# EAGLE design power-distribution (EAGLE 9.6.2)
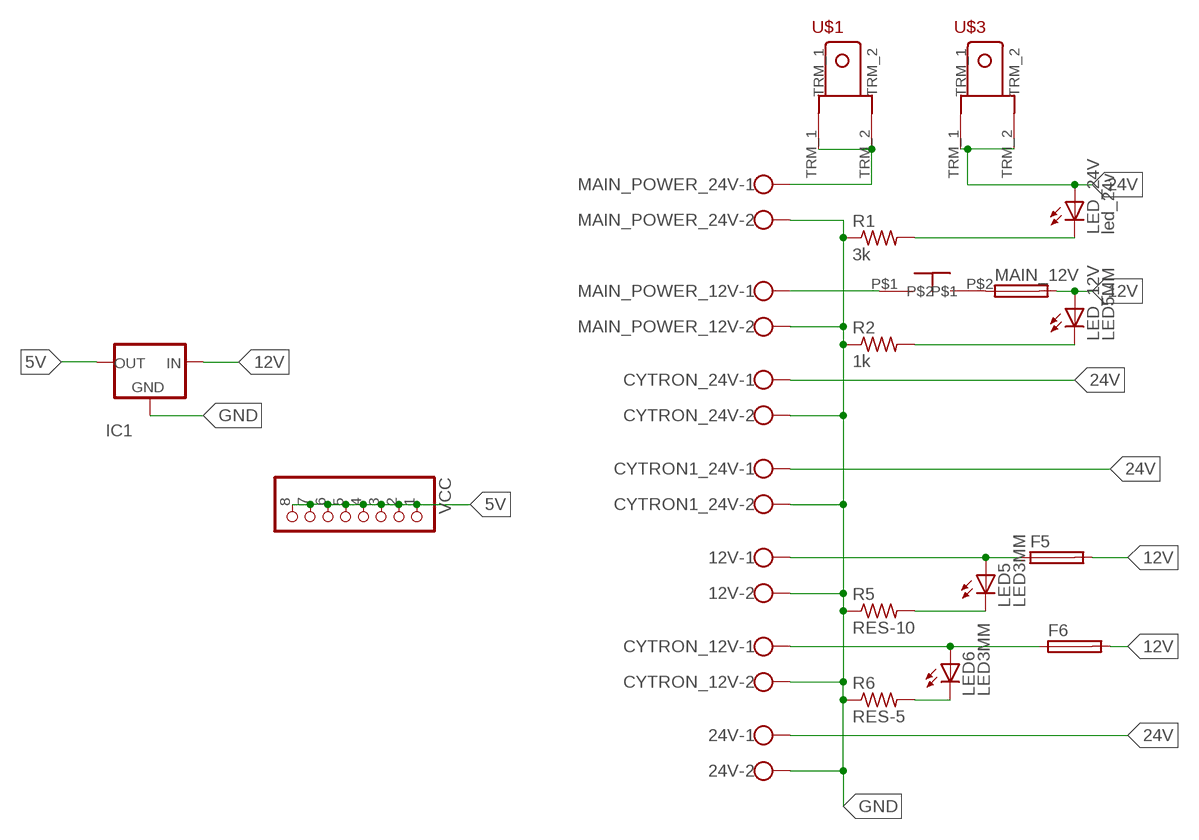
[diagram p0: schematic, sheet 1]

## Parts
12V  ROSTA.POWER  [W239-302]
24V  ROSTA.POWER  [W239-302]
CYTRON1_24V  ROSTA.POWER  [W239-302]
CYTRON_12V  ROSTA.POWER  [W239-302]
CYTRON_24V  ROSTA.POWER  [W239-302]
F5  FUSE_HOLDER  [SH22,5A]
F6  FUSE_HOLDER  [SH22,5A]
IC1  78XX-METAL  [TO3-79]
LED5  LED3MM  [LED3MM]
LED6  LED3MM  [LED3MM]
LED_12V  LED5MM  [LED5MM]
LED_24V  led_24v  LED5MM  [LED5MM]
MAIN_12V  FUSE_HOLDER  [SH22,5A]
MAIN_POWER_12V  ROSTA.POWER  [W239-302]
MAIN_POWER_24V  ROSTA.POWER  [W239-302]
R1  3k  RES-5  [0204/5]
R2  1k  RES-12  [0207/12]
R5  RES-10  [0207/10]
R6  RES-5  [0204/5]
U$1  TERMINAL_EDITED  [TERMINAL_EDITED]
U$2  SWITCH_2  [ON_OFF]
U$3  TERMINAL_EDITED  [TERMINAL_EDITED]
VCC  PINHD-1X8  [1X08]

## Nets
5V: IC1.1(OUT) VCC.1 VCC.2 VCC.3 VCC.4 VCC.5 VCC.6 VCC.7 VCC.8
12V: F5.2 F6.2 IC1.3(IN) LED_12V.A MAIN_12V.2
24V: 24V.1 CYTRON1_24V.1 CYTRON_24V.1 LED_24V.A U$3.TRM_1 U$3.TRM_2
GND: 12V.2 24V.2 CYTRON1_24V.2 CYTRON_12V.2 CYTRON_24V.2 IC1.2(GND) MAIN_POWER_12V.2 MAIN_POWER_24V.2 R1.1 R2.1 R5.1 R6.1
N$1: CYTRON_12V.1 F6.1 LED6.A
N$2: LED_24V.K(C) R1.2
N$3: MAIN_POWER_24V.1 U$1.TRM_1 U$1.TRM_2
N$4: LED_12V.K(C) R2.2
N$5: MAIN_POWER_12V.1 U$2.P$1
N$11: 12V.1 F5.1 LED5.A
N$12: LED5.K(C) R5.2
N$13: MAIN_12V.1 U$2.P$2
N$15: LED6.K(C) R6.2

## Library data of the parts
12V 24V CYTRON1_24V CYTRON_12V CYTRON_24V MAIN_POWER_12V MAIN_POWER_24V = MIA_LIBRARY-2-2-2:ROSTA.POWER: WAGO SCREW CLAMP; OC_FARNELL: unknown; OC_NEWARK: unknown
F5 F6 MAIN_12V = MIA_LIBRARY-2-2-2:FUSE_HOLDER
IC1 = MIA_LIBRARY-2-2-2:78XX-METAL: VOLTAGE REGULATOR
LED5 LED6 = MIA_LIBRARY-2-2-2:LED3MM
LED_12V LED_24V = MIA_LIBRARY-2-2-2:LED5MM
R1 R6 = MIA_LIBRARY-2-2-2:RES-5
R2 = MIA_LIBRARY-2-2-2:RES-12
R5 = MIA_LIBRARY-2-2-2:RES-10
U$1 U$3 = MIA_LIBRARY-2-2-2:TERMINAL_EDITED
U$2 = MIA_LIBRARY-2-2-2:SWITCH_2
VCC = MIA_LIBRARY-2-2-2:PINHD-1X8: PIN HEADER

## Board
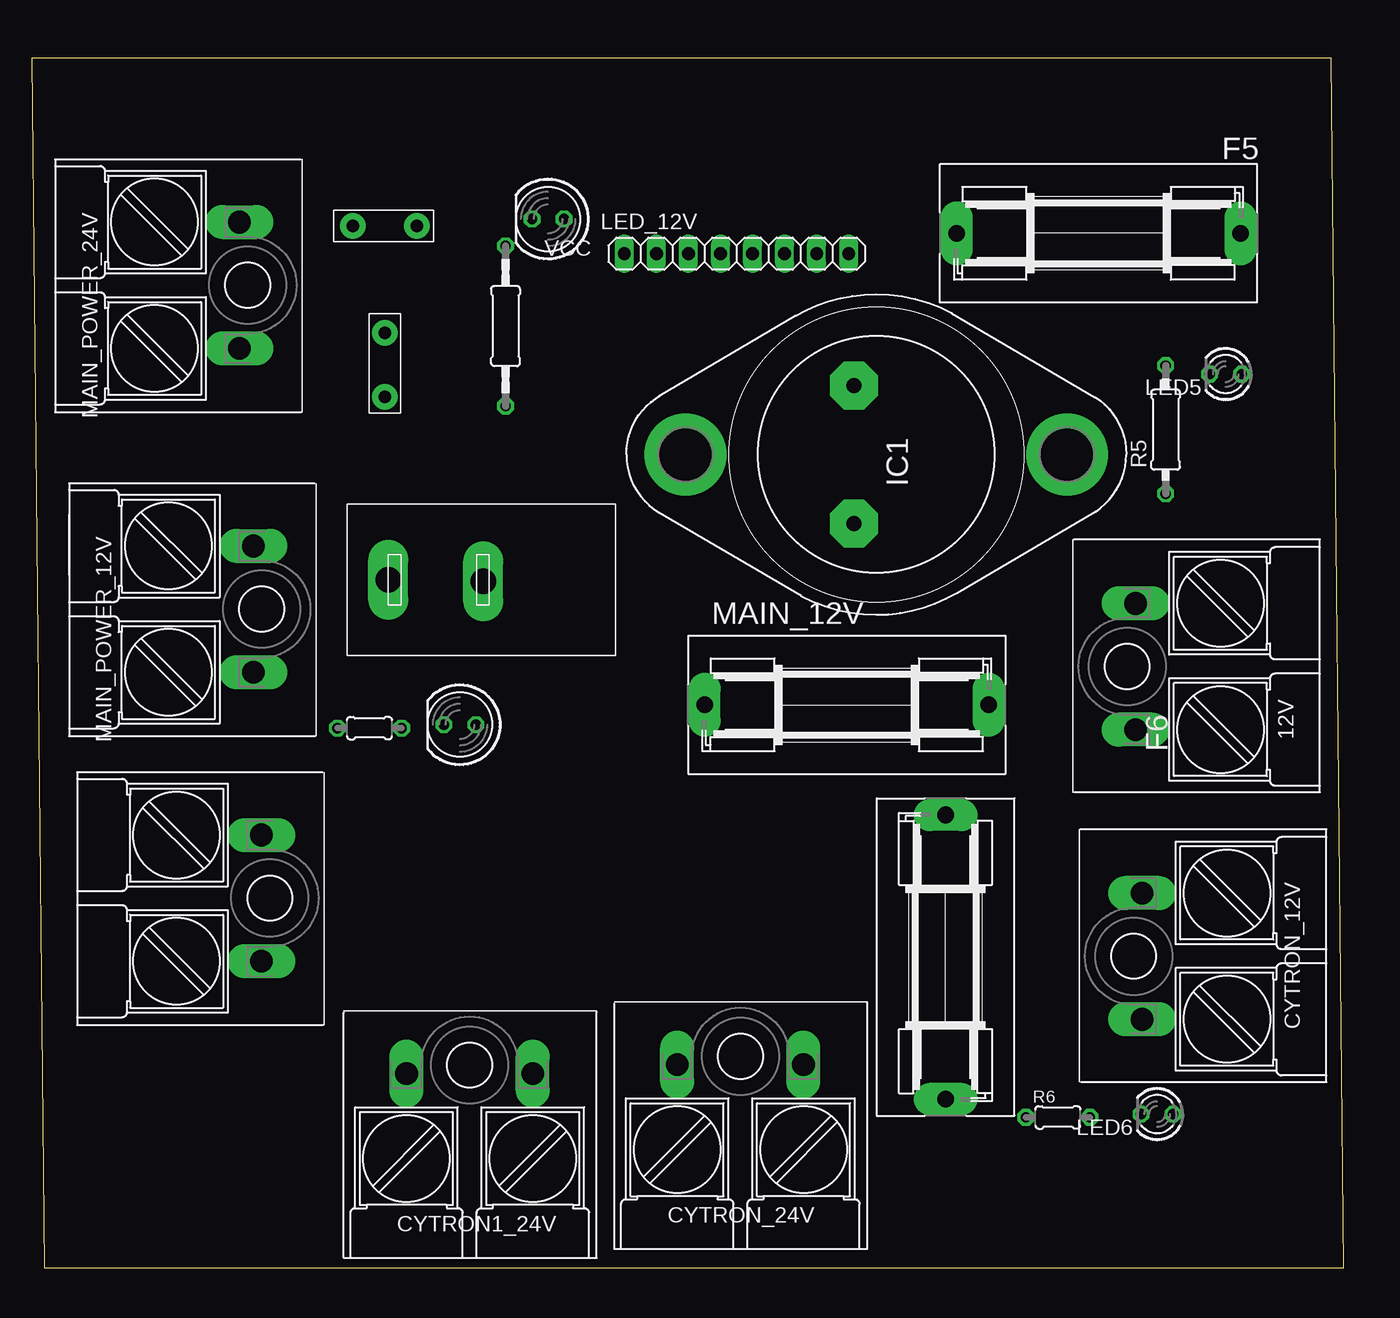
[diagram p1: board, top side]
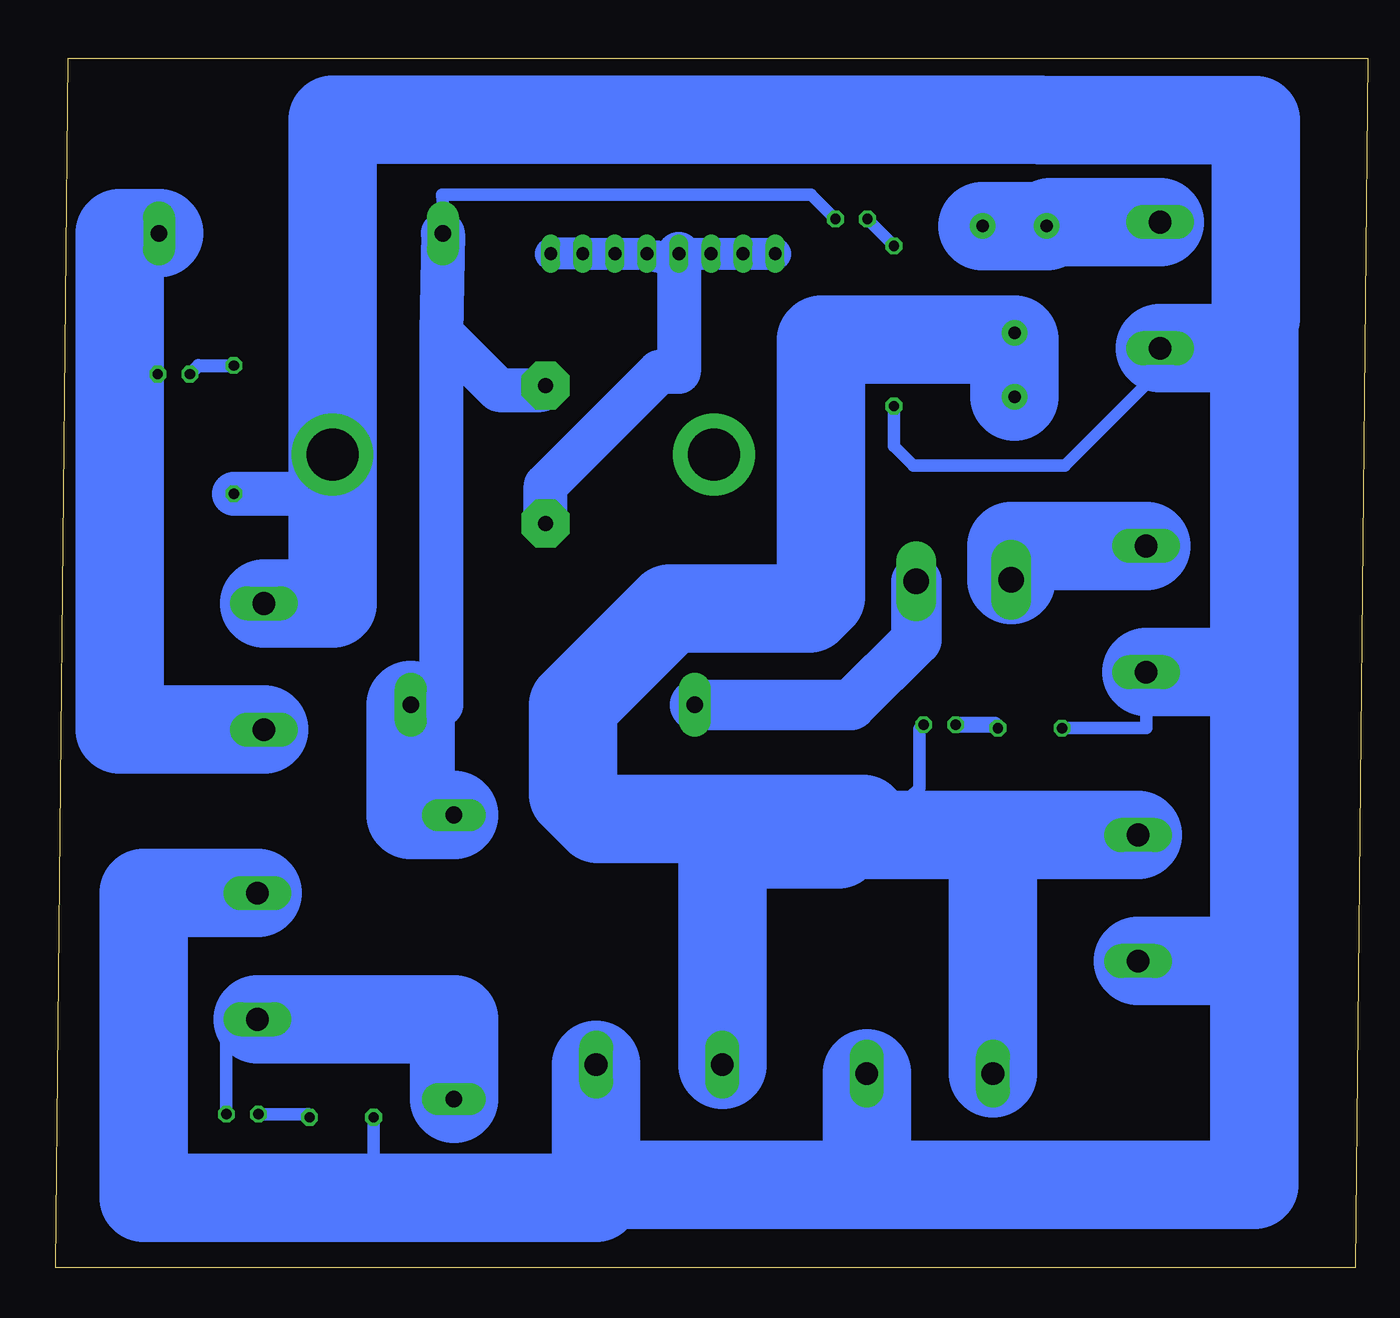
[diagram p2: board, bottom side, seen from below]

Size 104 x 95.84 mm. Coordinates in mm from the lower left corner, seen from the top.
Outline: 1,0 104,0 103,95.84 0,95.84 1,0
Copper layers (1*16): Top 0.035mm / dielectric 1.5mm / Bottom 0.035mm
Design rules "default *": minimum track width 1mm, minimum drill 0.6mm, track to track 0.6mm, track to pad 0.6mm, pad to pad 6mil, via to via 6mil, smd to smd 6mil, copper to edge 0.6mm, drill to drill 6mil, minimum pad ring 10mil, minimum via ring 8mil, stop-mask expansion 4mil, vias tented up to drill 0mil, thermal gap 10mil

### Footprints (pad centres in the part's own frame; a part is rotated, then mirrored left to right if it is on the bottom)
W239-302 = drill 1.8 long: 1 -5,5; 2 5,5
SH22,5A = drill 1.321 pad 2.54 long: 1 -11.252,0; 2 11.252,0
TO3-79 = drill 1.194 pad 3.81 octagon: 1 -1.778,-5.461; 3 -1.778,5.461 | drill 4.115 pad 6.477: 2 15.113,0; 3@ -15.113,0
LED3MM = drill 0.813 octagon: A -1.27,0; K 1.27,0
LED5MM = drill 0.813 octagon: A -1.27,0; K 1.27,0
0204/5 = drill 0.813 octagon: 1 -2.54,0; 2 2.54,0
0207/12 = drill 0.813 octagon: 1 -6.35,0; 2 6.35,0
0207/10 = drill 0.813 octagon: 1 -5.08,0; 2 5.08,0
TERMINAL_EDITED = drill 1 pad 2.032: TRM_1 -2.54,0; TRM_2 2.54,0
ON_OFF = drill 2.032 pad 3.175 long: P$1 3.27,5.952; P$2 10.795,5.842
1X08 = drill 1.016 long: 1 -8.89,0; 2 -6.35,0; 3 -3.81,0; 4 -1.27,0; 5 1.27,0; 6 3.81,0; 7 6.35,0; 8 8.89,0

### Placement (x,y rotation side)
12V  92.48,47.63 90 top
24V  13.22,29.28 270 top
CYTRON1_24V  34.72,10.38 0 top
CYTRON_12V  93,24.67 90 top
CYTRON_24V  56.16,11.08 0 top
F5  84.55,81.96 180 top
F6  72.43,24.61 90 top
IC1  66.94,64.43 0 top
LED5  94.62,70.8 180 top
LED6  89.19,12.15 180 top
LED_12V  40.93,83.09 180 top
LED_24V  33.94,43.02 180 top
MAIN_12V  64.6,44.59 0 top
MAIN_POWER_12V  12.57,52.18 270 top
MAIN_POWER_24V  11.48,77.85 270 top
R1  26.78,42.75 0 top
R2  37.56,74.61 90 top
R5  89.87,66.4 90 top
R6  81.33,11.9 0 top
U$1  28,82.54 0 top
U$2  25,48.54 0 top
U$3  28,71.54 270 top
VCC  55.86,80.35 0 top

### Tracks (layer width: path | path; a pad name or v marks a point on that pad's centre or on a via)
5V
  Bottom 1.016: VCC.5 56.86,80.62 56.36,80.12
  Bottom 2.54: VCC.8 VCC.7 VCC.6 VCC.5 | 56.36,80.12 54.82,80.12 VCC.4 VCC.3 VCC.2 VCC.1
  Bottom 3.5: VCC.4 54.59,70.97 56.16,70.97 65.16,61.97 IC1.1
12V
  Bottom 1: LED_12V.A 44.15,85.04 73.36,85.04 73.3,84.13 F5.2
  Bottom 3.5: IC1.3 65.52,69.54 68.88,69.54 73.44,74.1 | F5.2 73.44,74.1 | 73.44,74.1 73.44,44.59 MAIN_12V.2
  Bottom 7: MAIN_12V.2 75.85,35.86 F6.2
24V
  Bottom 1: LED_24V.A 35.53,42.7 35.53,38.01 36,37.54 36,34.28
  Bottom 1.016: U$3.TRM_1 28,73.54
  Bottom 7: U$3.TRM_2 28,73.54 43.3,73.54 43.35,73.49 43.35,53.19 44.31,52.23 55.31,52.23 63,44.54 63,37.54 61,35.54 40,35.54 41.26,34.28 | 24V.1 29.71,34.28 | 41.26,34.28 36,34.28 29.71,34.28 | 41.26,34.28 42,33.54 51.16,33.54 CYTRON_24V.1 | CYTRON1_24V.1 29.71,34.28
GND
  Bottom 1: R2.1 37.56,65.1 36,63.54 24,63.54 16.48,71.06 MAIN_POWER_24V.2 | R1.1 17.57,42.75 MAIN_POWER_12V.2 | R6.1 78.79,4.54 74,4.54 74,5.54
  Bottom 3.5: R5.1 83,61.32 83,60.54 82.06,60.54 IC1.2
  Bottom 7: 24V.2 9,24.28 | 9,24.28 9,47.18 | MAIN_POWER_12V.2 9,47.18 | CYTRON1_24V.2 39.72,6.54 | 39.72,6.54 9,6.54 9,24.28 | 39.72,6.54 61.16,6.54 | 61.16,6.54 CYTRON_24V.2 | CYTRON_12V.2 97,29.67 97,5.54 74,5.54 61.16,5.54 61.16,6.54 | 9,47.18 9,72.85 | 9,72.85 9,75.25 8.88,75.25 8.88,90.92 25.97,90.92 26,90.95 82.06,90.95 IC1.2 82.06,52.63 12V.2 | MAIN_POWER_24V.2 9,72.85
N$1
  Bottom 1: LED6.A 90.46,19.67 CYTRON_12V.1
  Bottom 7: CYTRON_12V.1 72.43,19.67 F6.1
N$2
  Bottom 1.27: LED_24V.K 29.59,43.02 R1.2
N$3
  Bottom 7: U$1.TRM_2 U$1.TRM_1 25.15,82.85 MAIN_POWER_24V.1
N$4
  Bottom 1: LED_12V.K 37.56,80.99 R2.2
N$5
  Bottom 7: MAIN_POWER_12V.1 28.27,57.18 U$2.P$1
N$11
  Bottom 1: LED5.A 98,70.8 98,64.54 98.9,64.54
  Bottom 7: 12V.1 98.9,42.63 98.9,64.54 98.9,81.96 F5.1
N$12
  Bottom 1.016: LED5.K 92.67,71.48 R5.2
N$13
  Bottom 4: MAIN_12V.1 40.95,44.59 35.8,49.74 U$2.P$2
N$15
  Bottom 1: LED6.K 83.89,12.15 R6.2